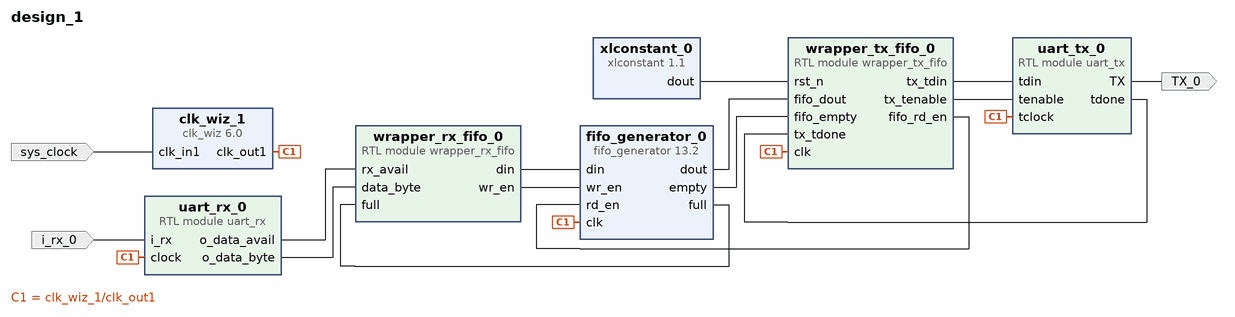
[diagram p0: block diagram of the top level]
# Vivado block design design_1, xc7z010clg400-1, Vivado 2022.2
create_bd_design design_1

create_bd_port -dir I -type clk sys_clock
set_property -dict {CONFIG.FREQ_HZ 125000000 CONFIG.PHASE 0.0} [get_bd_ports sys_clock]
create_bd_port -dir I i_rx_0
create_bd_port -dir O TX_0

create_bd_cell -type ip -vlnv xilinx.com:ip:fifo_generator:13.2 fifo_generator_0
set_property -dict [list \
  CONFIG.Input_Data_Width 8 \
  CONFIG.Performance_Options First_Word_Fall_Through \
  CONFIG.Reset_Pin false \
] [get_bd_cells fifo_generator_0]
create_bd_cell -type module -reference wrapper_rx_fifo wrapper_rx_fifo_0
create_bd_cell -type module -reference wrapper_tx_fifo wrapper_tx_fifo_0
create_bd_cell -type ip -vlnv xilinx.com:ip:xlconstant:1.1 xlconstant_0
create_bd_cell -type ip -vlnv xilinx.com:ip:clk_wiz:6.0 clk_wiz_1
set_property -dict [list \
  CONFIG.CLKOUT1_JITTER 119.348 \
  CONFIG.CLKOUT1_REQUESTED_OUT_FREQ 125.000 \
  CONFIG.CLK_IN1_BOARD_INTERFACE sys_clock \
  CONFIG.MMCM_CLKOUT0_DIVIDE_F 8.000 \
  CONFIG.USE_BOARD_FLOW true \
  CONFIG.USE_LOCKED false \
  CONFIG.USE_RESET false \
] [get_bd_cells clk_wiz_1]
create_bd_cell -type module -reference uart_tx uart_tx_0
create_bd_cell -type module -reference uart_rx uart_rx_0

# ---- connections ----

connect_bd_net [get_bd_pins clk_wiz_1/clk_out1] \
  [get_bd_pins fifo_generator_0/clk] [get_bd_pins wrapper_tx_fifo_0/clk] [get_bd_pins uart_tx_0/tclock] \
  [get_bd_pins uart_rx_0/clock]
connect_bd_net [get_bd_pins fifo_generator_0/dout] [get_bd_pins wrapper_tx_fifo_0/fifo_dout]
connect_bd_net [get_bd_pins fifo_generator_0/empty] [get_bd_pins wrapper_tx_fifo_0/fifo_empty]
connect_bd_net [get_bd_pins fifo_generator_0/full] [get_bd_pins wrapper_rx_fifo_0/full]
connect_bd_net -net i_rx_0_1 [get_bd_ports i_rx_0] [get_bd_pins uart_rx_0/i_rx]
connect_bd_net [get_bd_ports sys_clock] [get_bd_pins clk_wiz_1/clk_in1]
connect_bd_net [get_bd_pins uart_rx_0/o_data_avail] [get_bd_pins wrapper_rx_fifo_0/rx_avail]
connect_bd_net [get_bd_pins uart_rx_0/o_data_byte] [get_bd_pins wrapper_rx_fifo_0/data_byte]
connect_bd_net [get_bd_pins uart_tx_0/TX] [get_bd_ports TX_0]
connect_bd_net [get_bd_pins uart_tx_0/tdone] [get_bd_pins wrapper_tx_fifo_0/tx_tdone]
connect_bd_net [get_bd_pins wrapper_rx_fifo_0/din] [get_bd_pins fifo_generator_0/din]
connect_bd_net [get_bd_pins wrapper_rx_fifo_0/wr_en] [get_bd_pins fifo_generator_0/wr_en]
connect_bd_net [get_bd_pins wrapper_tx_fifo_0/fifo_rd_en] [get_bd_pins fifo_generator_0/rd_en]
connect_bd_net [get_bd_pins wrapper_tx_fifo_0/tx_tdin] [get_bd_pins uart_tx_0/tdin]
connect_bd_net [get_bd_pins wrapper_tx_fifo_0/tx_tenable] [get_bd_pins uart_tx_0/tenable]
connect_bd_net [get_bd_pins xlconstant_0/dout] [get_bd_pins wrapper_tx_fifo_0/rst_n]

validate_bd_design
save_bd_design
